# EasyEDA schematic SCH_Key chain Finder1_2023-02-19.json
TITLE: Sheet_1; REV: 1.0; Date: 2023-02-18; Sheet: 1/1; Drawn By: karthikeyapatneedi; Company: Your Company
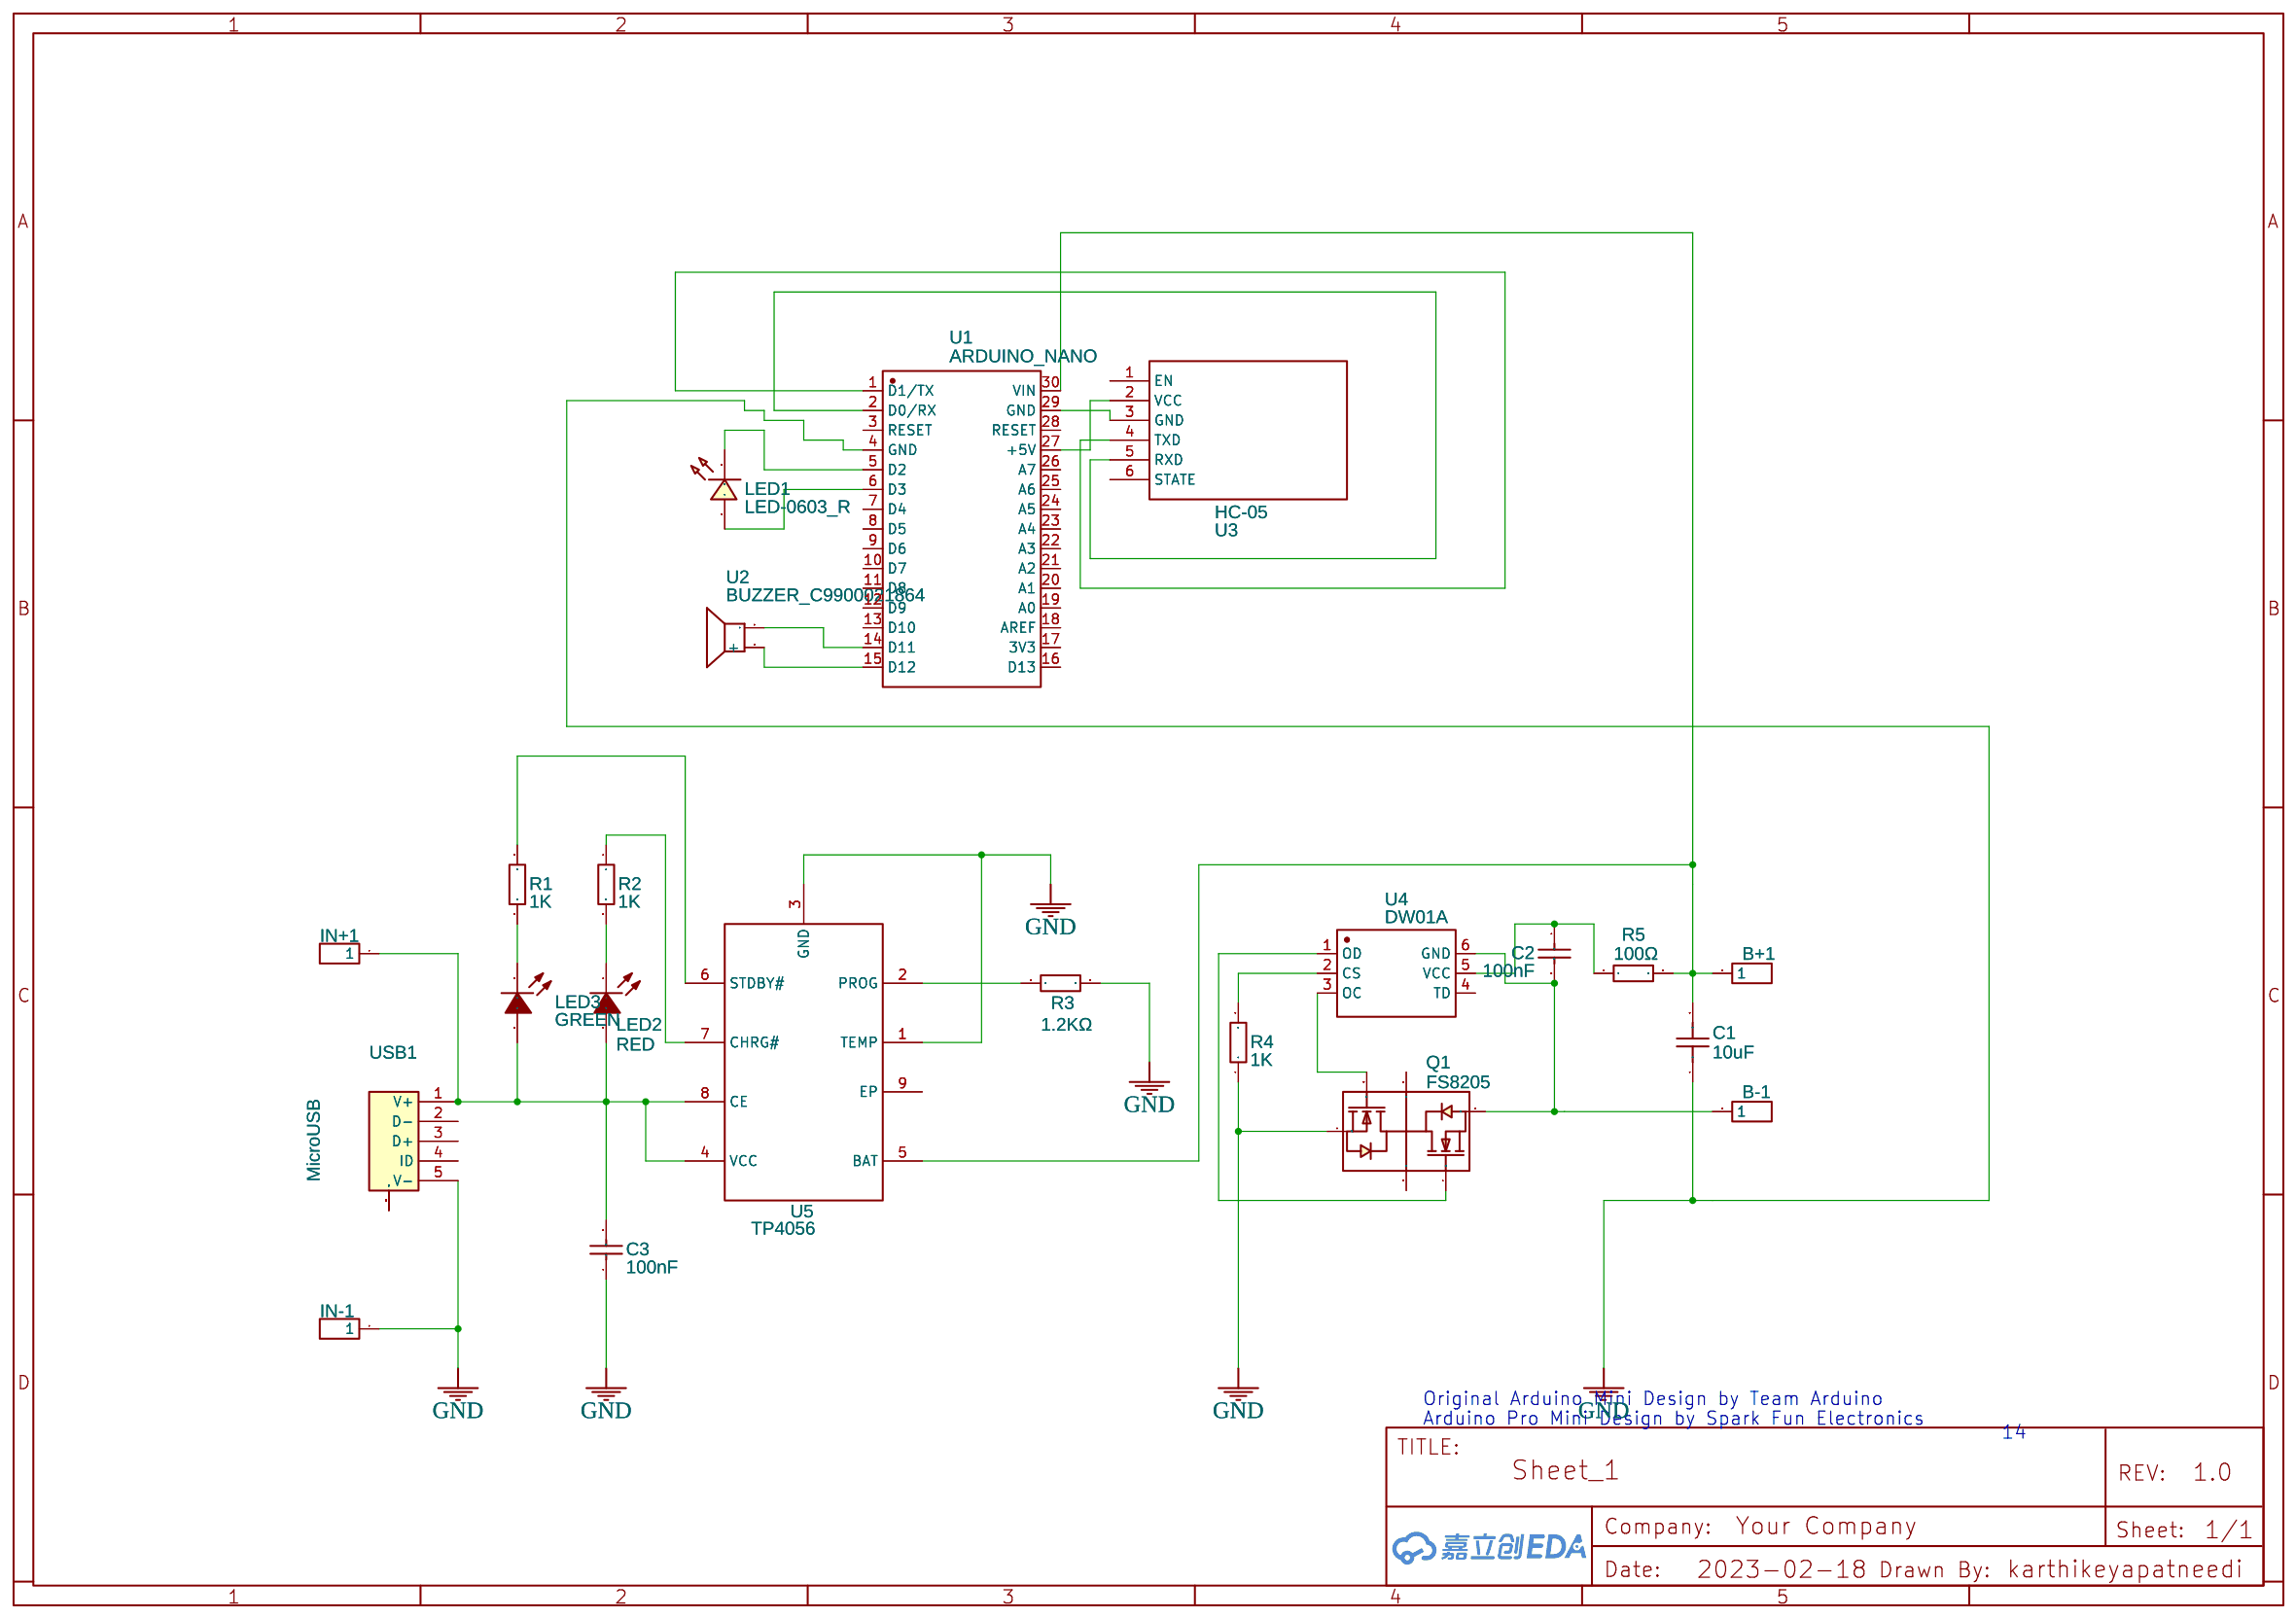
[diagram p0: schematic sheet]

## Parts
B+1  Header-Male-2.54_1x1  [HDR-1X1/2.54]
B-1  Header-Male-2.54_1x1  [HDR-1X1/2.54]
C1  10uF  [C0603]
C2  100nF  [C0603]
C3  100nF  [C0603]
IN+1  Header-Male-2.54_1x1  [HDR-TH_1P-P2.54-V-M]
IN-1  Header-Male-2.54_1x1  [HDR-TH_1P-P2.54-V-M]
LED1  LED-0603_R  [LED0603_RED]
LED2  RED  [LED0603-RD]
LED3  GREEN  [LED0603-RD]
Q1  FS8205  [SOT-23-6_L2.9-W1.6-P0.95-LS2.8-BR]
R1  1K  [R0603]
R2  1K  [R0603]
R3  1.2KΩ  [R0603]
R4  1K  [R0603]
R5  100Ω  [R0603]
U1  ARDUINO_NANO  [COMM-TH_ARDUINO_NANO]
U2  BUZZER_C9900021864  [BUZ-SMD_BUZZER]
U3  HC-05  [HC-05 PCB]
U4  DW01A  [SOT-23-6_L2.9-W1.6-P0.95-LS2.8-BR]
U5  TP4056  [ESOP-8_L4.9-W3.9-P1.27-LS6.0-BL-EP]
USB1  MicroUSB  [MICRO-USB-SMD_5P-P0.65-H-F_C10418]

## Library data of the parts
B+1 B-1 = -: Supplier Part: C81276; Supplier: LCSC; Manufacturer: ReliaPro
C1 = CL10A106MP8NNNC: Supplier: LCSC; Manufacturer: SAMSUNG(三星); Supplier Part: C85713; JLCPCB Part Class: Extended Part
C2 C3 = 0603B104K250: Supplier: LCSC; Manufacturer: Walsin(华新科); Manufacturer Part: 0603B104K250CT; Supplier Part: C83054; JLCPCB Part Class: Extended Part
IN+1 IN-1 = Header-Male-2.54_1x1: Supplier Part: C81276; Supplier: LCSC; Manufacturer: BOOMELE(博穆精密); Manufacturer Part: 2.54-1*1P针; JLCPCB Part Class: Extended Part
LED1 = LED-0603_R: Manufacturer: EVERLIGHT(台湾亿光); Manufacturer Part: 19-217/R6C-AL1M2VY/3T; Supplier Part: C72044; Supplier: LCSC; Contributor: LCEDA_01
LED2 = LTST-C191KRKT: Supplier: LCSC; Manufacturer: LITEON(光宝); Contributor: LCSC; Supplier Part: C125099; JLCPCB Part Class: Extended Part
LED3 = LTST-C193TGKT-5A: Supplier: LCSC; Manufacturer: LITEON(光宝); Supplier Part: C12065; JLCPCB Part Class: Extended Part
Q1 = FS8205: Supplier: LCSC; Manufacturer: FORTUNE(富晶); LCSC Assembly: Yes; image: //image.lceda.cn/szlcsc/C32254.jpg; Supplier Part: C32254; JLCPCB Part Class: Extended Part
R1 R2 R4 = ERJ3GEYJ102V: Supplier: LCSC; Manufacturer: PANASONIC(松下); Contributor: LCSC; Supplier Part: C180848; JLCPCB Part Class: Extended Part
R3 = RC0603JR-071K2L: Supplier: LCSC; Manufacturer: YAGEO(国巨); Supplier Part: C114679; JLCPCB Part Class: Extended Part; Resistance: 1.2kΩ
R5 = 0603WAJ0101T5E: Supplier: LCSC; Manufacturer: UNI-ROYAL(厚声); Supplier Part: C25201; Resistance (Ohms): 100; JLCPCB Part Class: Extended Part
U1 = ARDUINO_NANO: Supplier: LCSC; Supplier Part: C9900017879; Manufacturer: null; JLCPCB Part Class: Extended Part; Contributor: lcsc
U2 = BUZZER_C9900021864: Supplier: LCSC; Supplier Part: C9900021864; Manufacturer: null; Manufacturer Part: BUZZER; JLCPCB Part Class: Extended Part; Contributor: lcsc
U3 = -: Contributor: HariEDA
U4 = DW01A-G: Supplier: LCSC; Manufacturer: FORTUNE(富晶); Contributor: LCSC; Supplier Part: C61503; JLCPCB Part Class: Extended Part
U5 = TP4056: Contributor: Guest; Supplier: LCSC; Manufacturer: TOPPOWER(南京拓微); Manufacturer Part: TP4056-42-ESOP8; LCSC Assembly: Yes; image: //image.lceda.cn/szlcsc/C16581.jpg; Supplier Part: C16581; JLCPCB Part Class: Basic Part
USB1 = micro USBFemale: Supplier: LCSC; Manufacturer: 精拓金; Manufacturer Part: 920-E52A2021S10100; image: //image.lceda.cn/szlcsc/C10418.jpg; Supplier Part: C10418; JLCPCB Part Class: Extended Part

## Nets
GND: C1.1 C3.1 IN-1.1 Q1.1(S1) R3.2 R4.1 U1.4(GND) U5.1(TEMP) U5.3(GND) USB1.5(V-)
Net-(B+1-1): B+1.1 C1.2 R5.2 U1.30(VIN) U5.5(BAT)
Net-(B-1-1): B-1.1 C2.2 Q1.3(S2) U4.6(GND)
Net-(C2-1): C2.1 R5.1 U4.5(VCC)
Net-(C3-2): C3.2 IN+1.1 LED2.2(+) LED3.2(A) U5.4(VCC) U5.8(CE) USB1.1(V+)
Net-(LED1-1): LED1.1 U1.6(D3)
Net-(LED1-2): LED1.2 U1.5(D2)
Net-(LED2-1): LED2.1(-) R2.2
Net-(LED3-1): LED3.1(K) R1.1
Net-(Q1-4): Q1.4(G2) U4.1(OD)
Net-(Q1-6): Q1.6(G1) U4.3(OC)
Net-(R1-2): R1.2 U5.6(STDBY#)
Net-(R2-1): R2.1 U5.7(CHRG#)
Net-(R3-1): R3.1 U5.2(PROG)
Net-(R4-2): R4.2 U4.2(CS)
Net-(U1-1): U1.1(D1/TX) U3.4(TXD)
Net-(U1-2): U1.2(D0/RX) U3.5(RXD)
Net-(U1-14): U1.14(D11) U2.1
Net-(U1-15): U1.15(D12) U2.2(+)
Net-(U1-27): U1.27(+5V) U3.2(VCC)
Net-(U1-29): U1.29(GND) U3.3(GND)
Net-(USB1-SH0): USB1.SH0(MTN) USB1.SH1(1) USB1.SH2(2) USB1.SH3(3)

Not connected (* = marked no-connect by the designer): Q1 2(D12) 5(D12); U1 3(RESET) 7(D4) 8(D5) 9(D6) 10(D7) 11(D8) 12(D9) 13(D10) 16(D13) 17(3V3) 18(AREF) 19(A0) 20(A1) 21(A2) 22(A3) 23(A4) 24(A5) 25(A6) 26(A7) 28(RESET); U3 1(EN) 6(STATE); U4 4(TD); U5 9(EP); USB1 2(D-) 3(D+) 4(ID)

## Notes on the sheet
- Original Arduino Mini Design by Team Arduino
- Arduino Pro Mini Design by Spark Fun Electronics
- 14
